# Altium schematic sheet MainControl20V05.SchDoc
size A1; Time: 2019-11-17
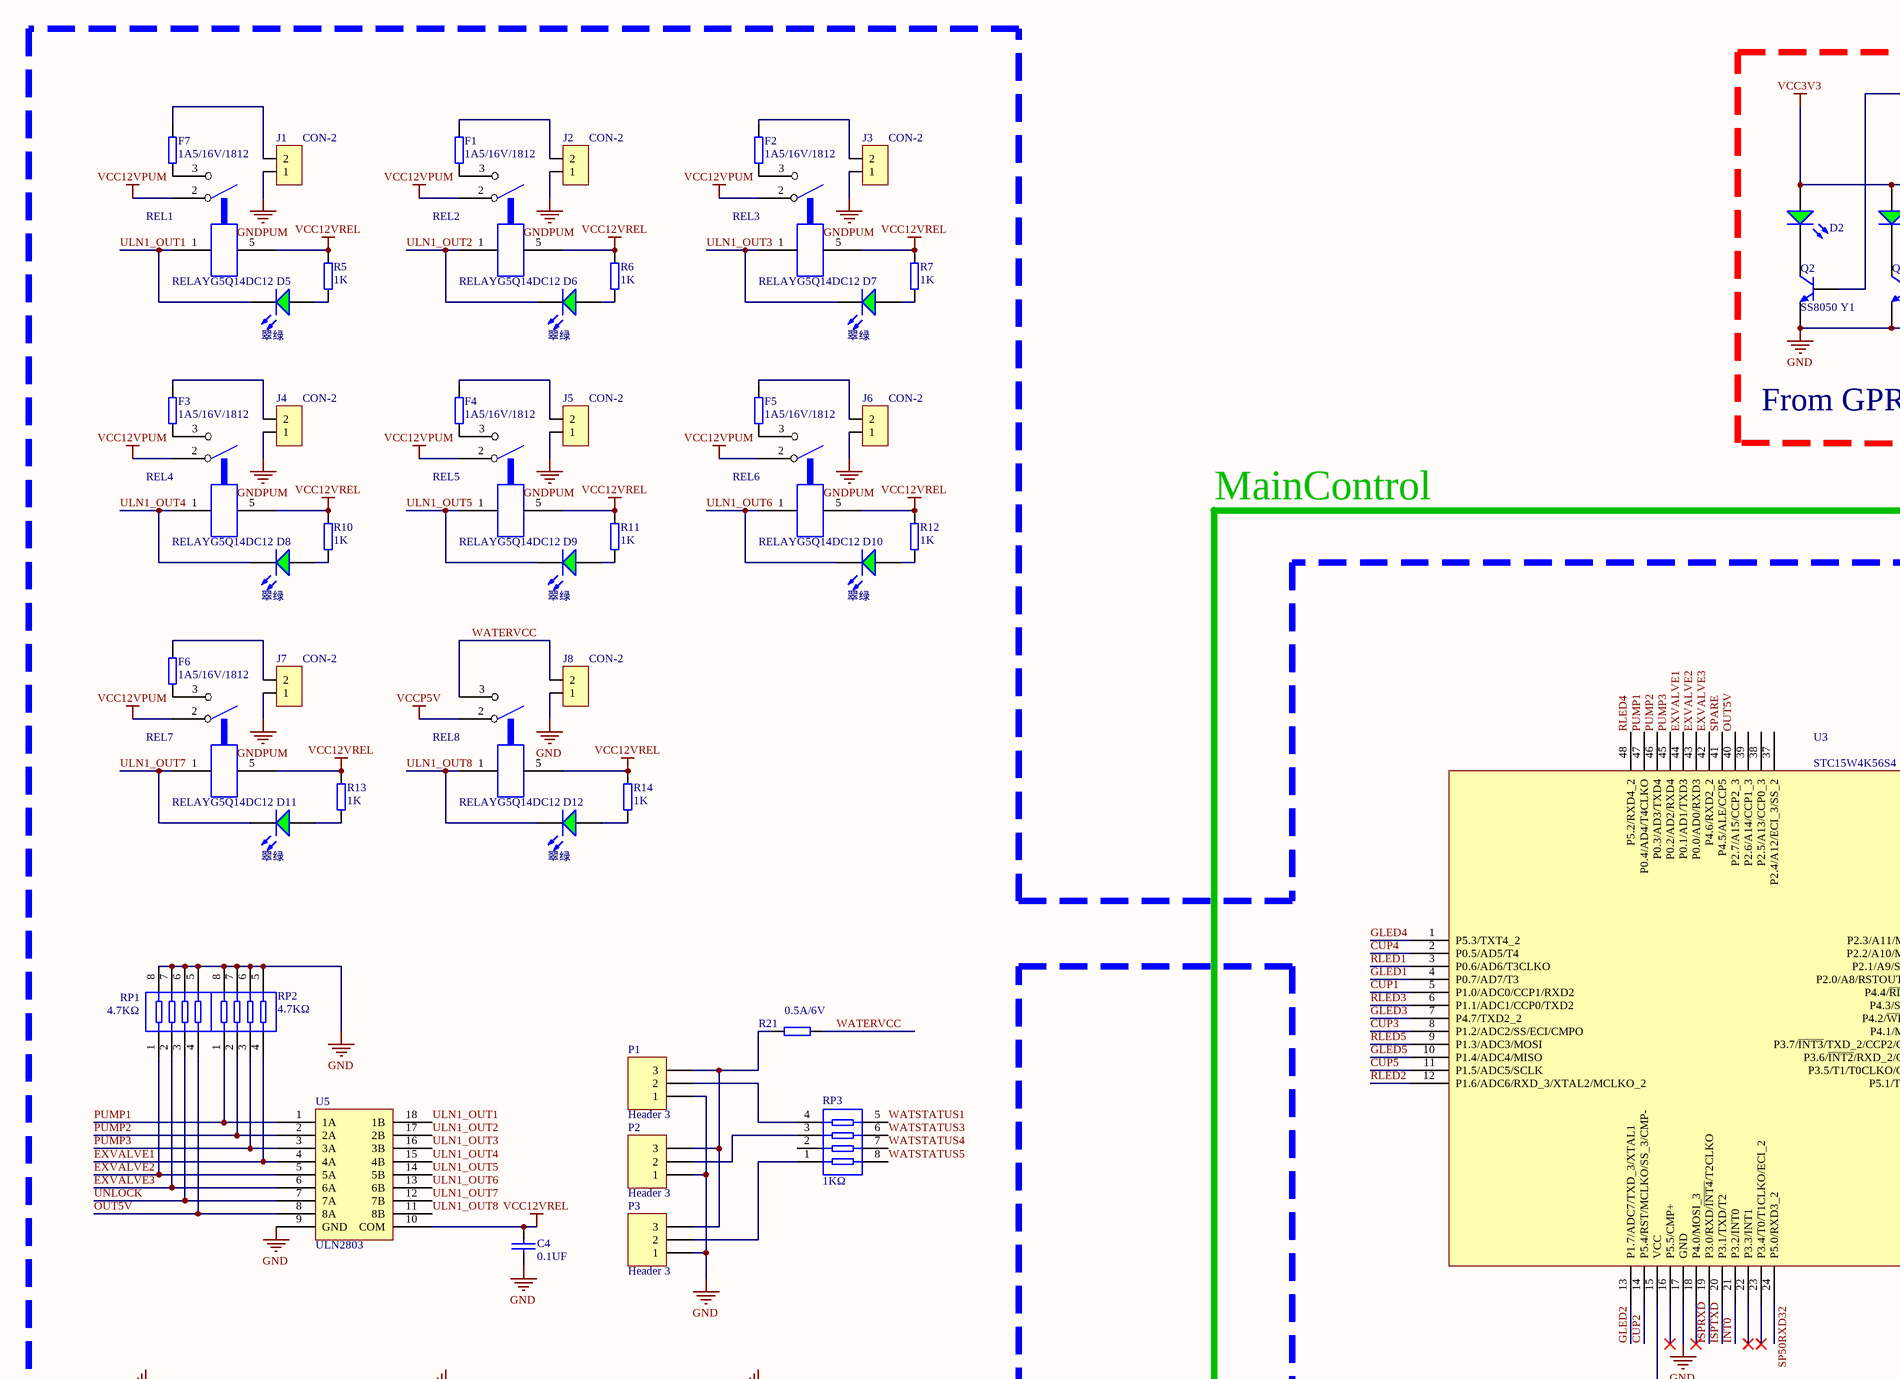
[diagram p0: MainControl20V05.SchDoc, top left]
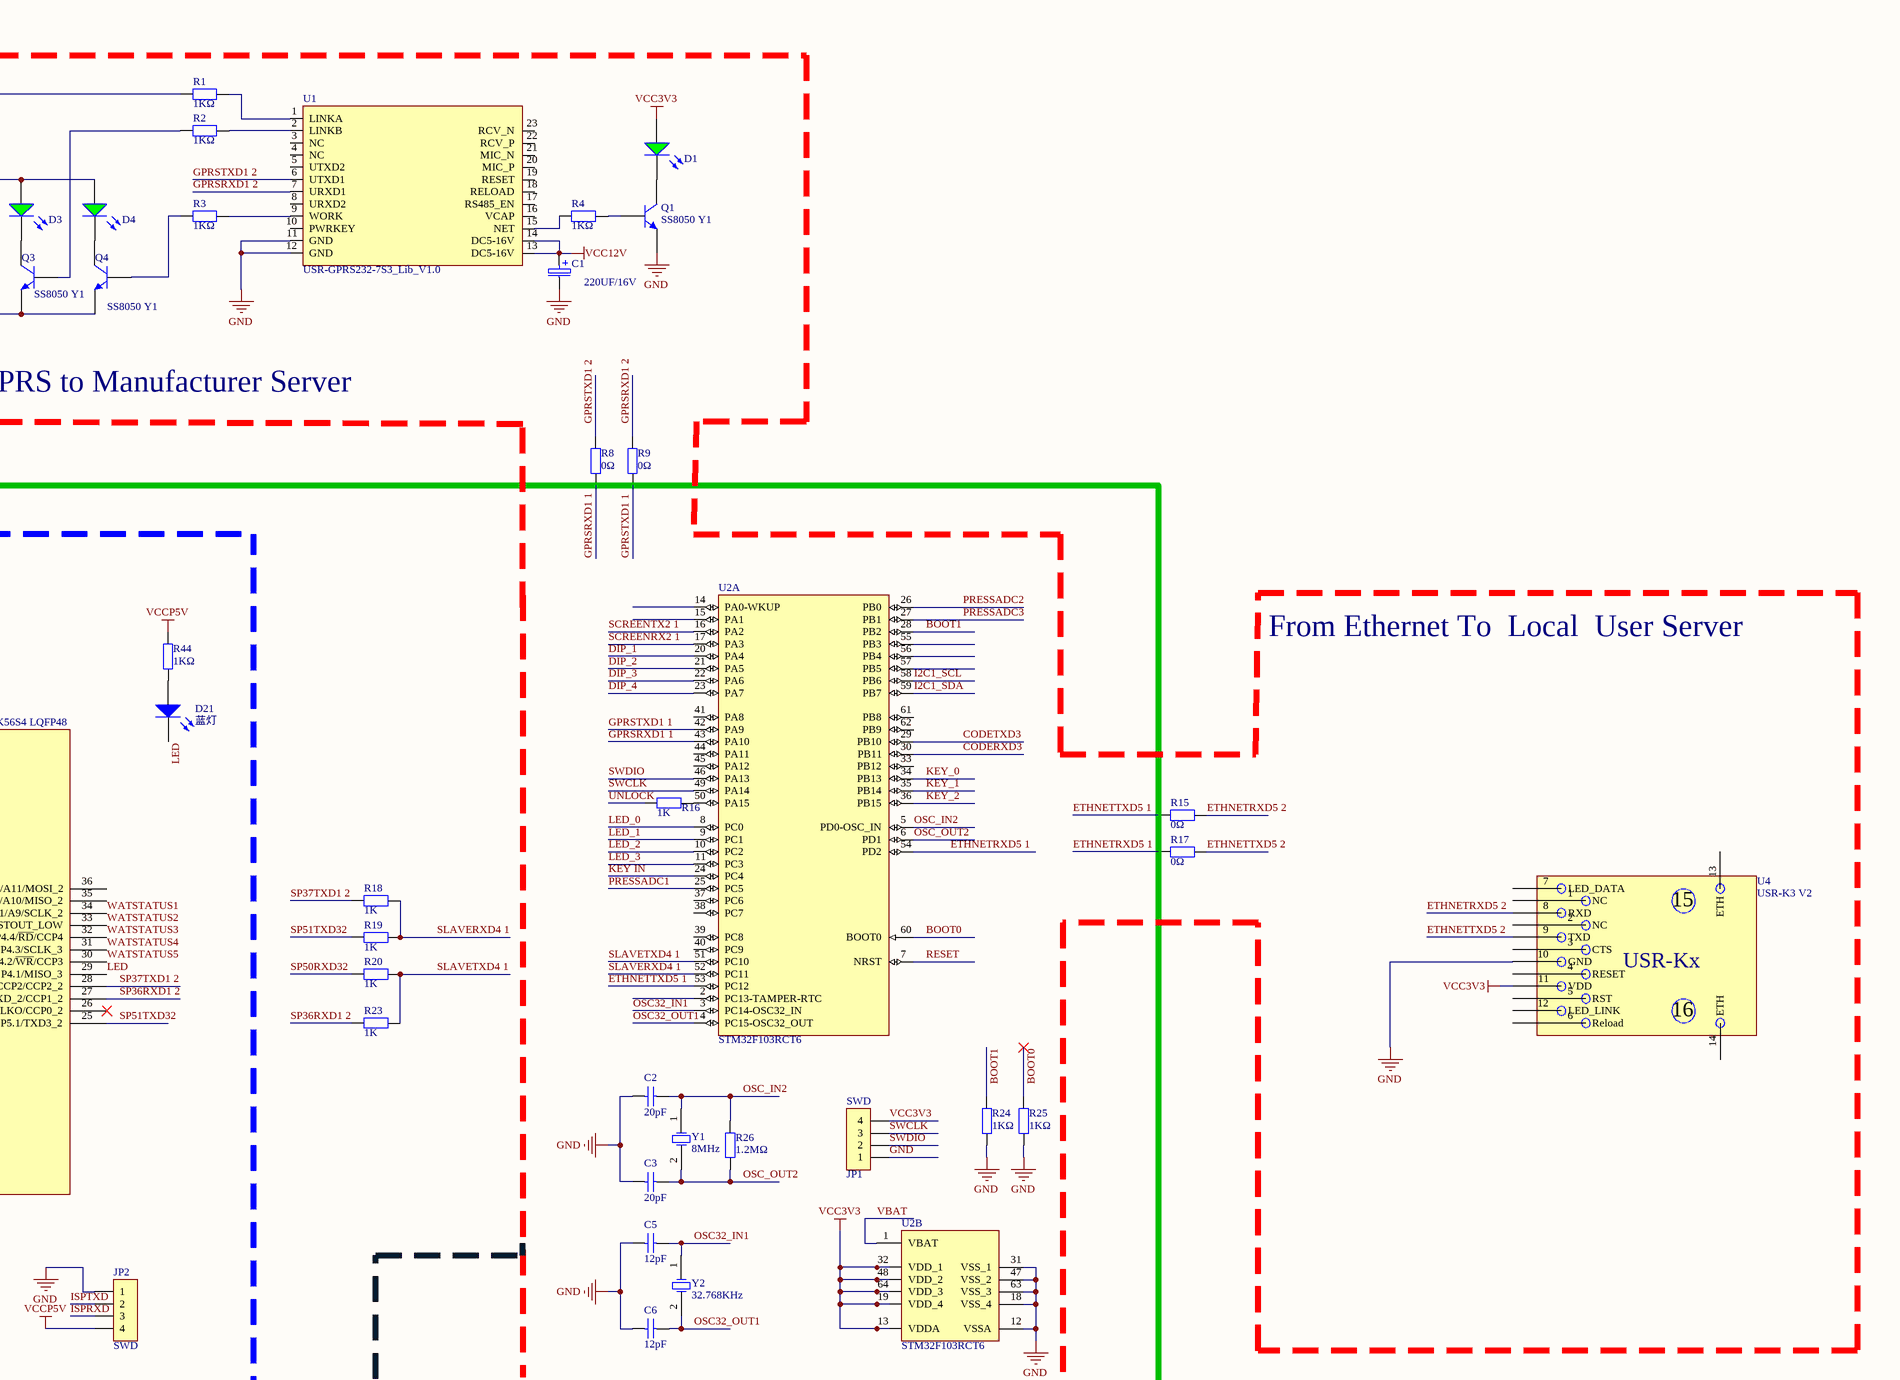
[diagram p1: MainControl20V05.SchDoc, top right]
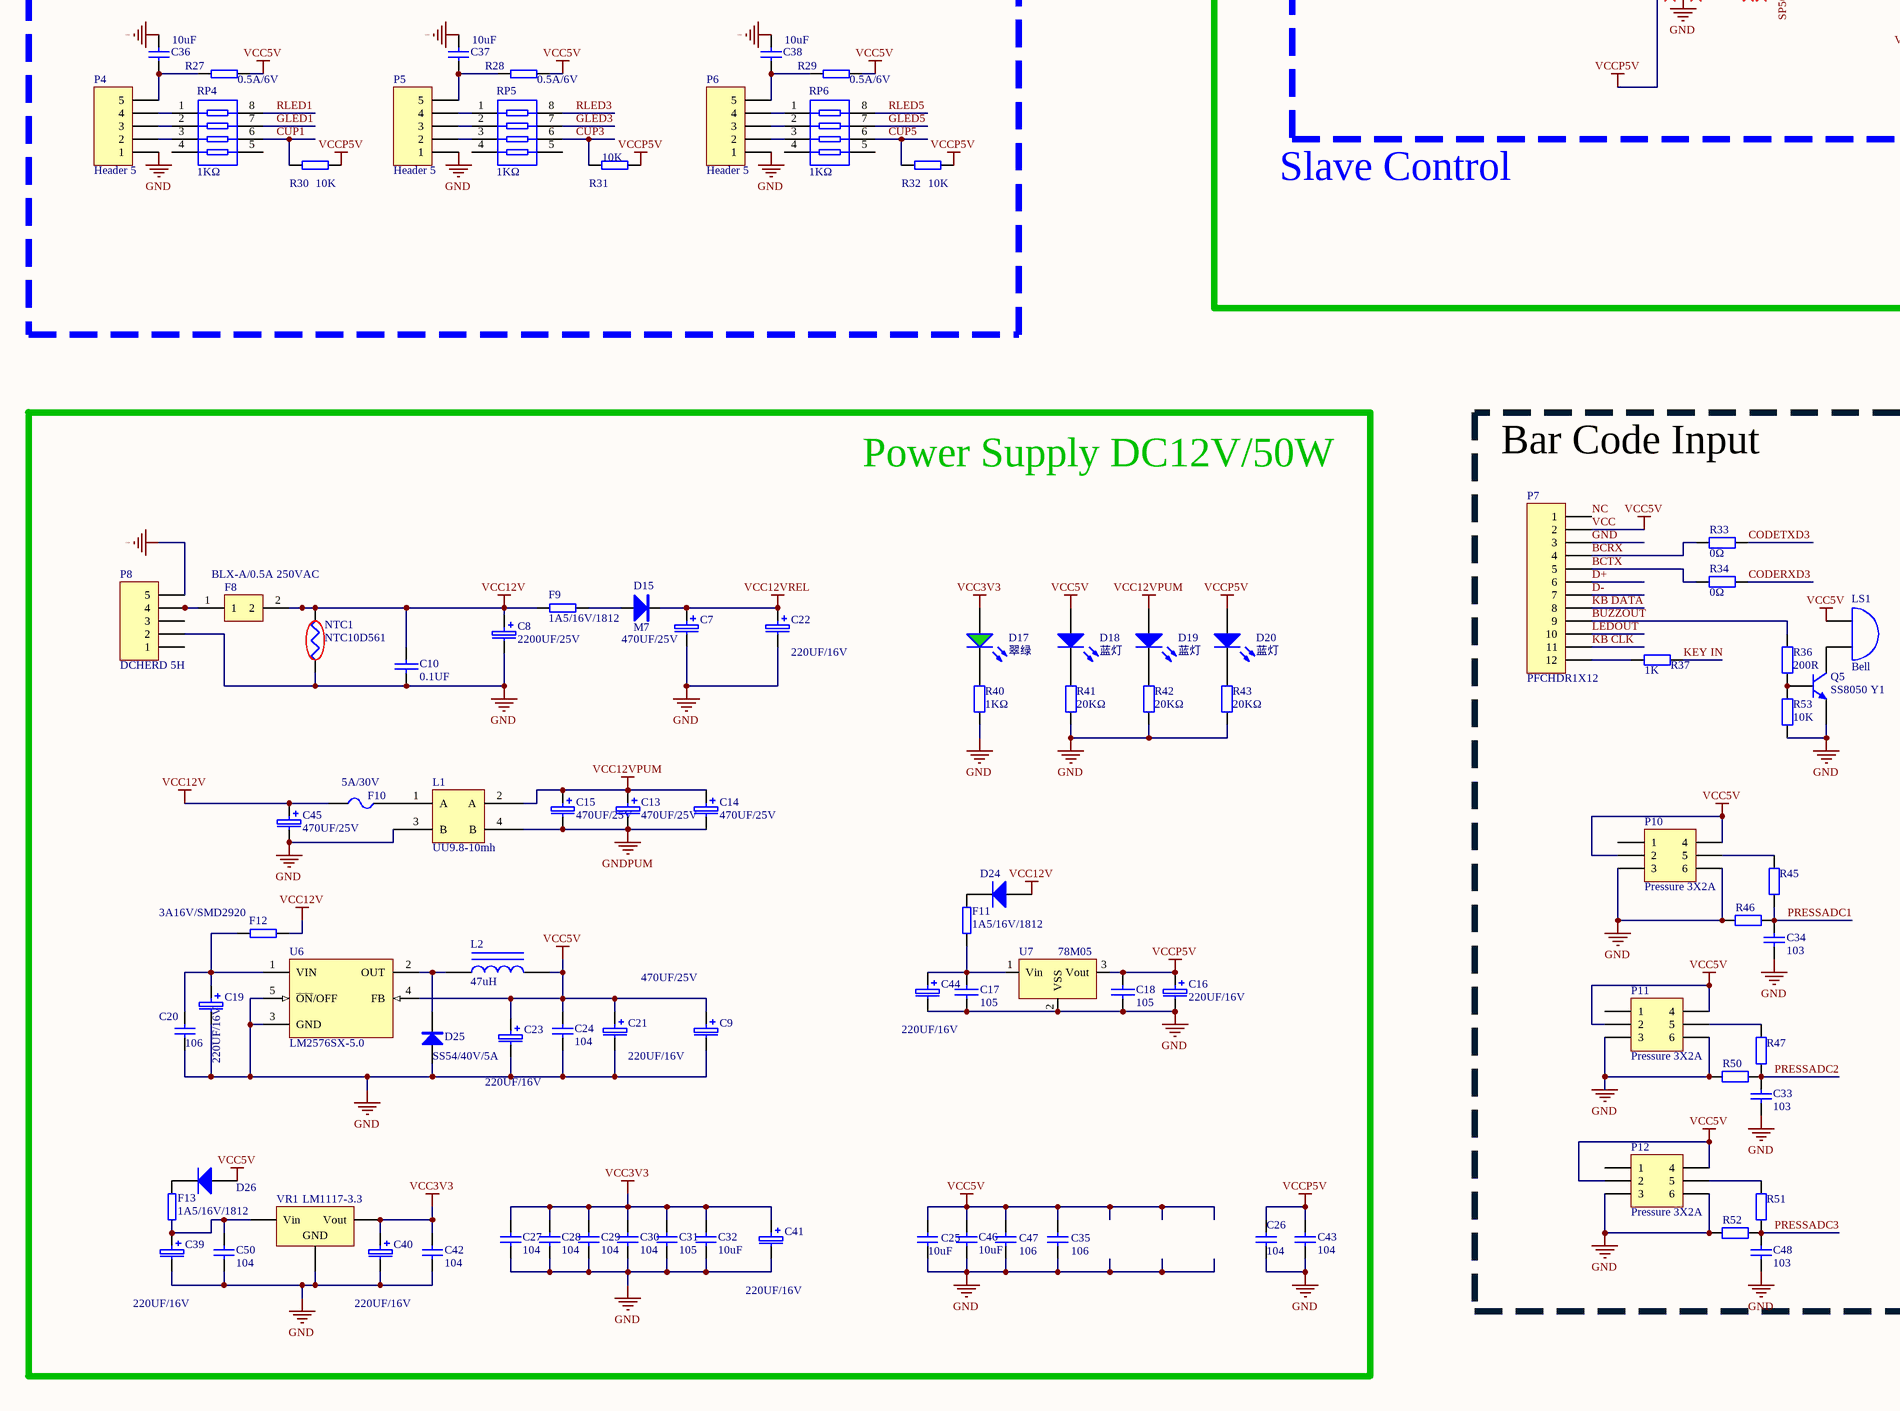
[diagram p2: MainControl20V05.SchDoc, bottom left]
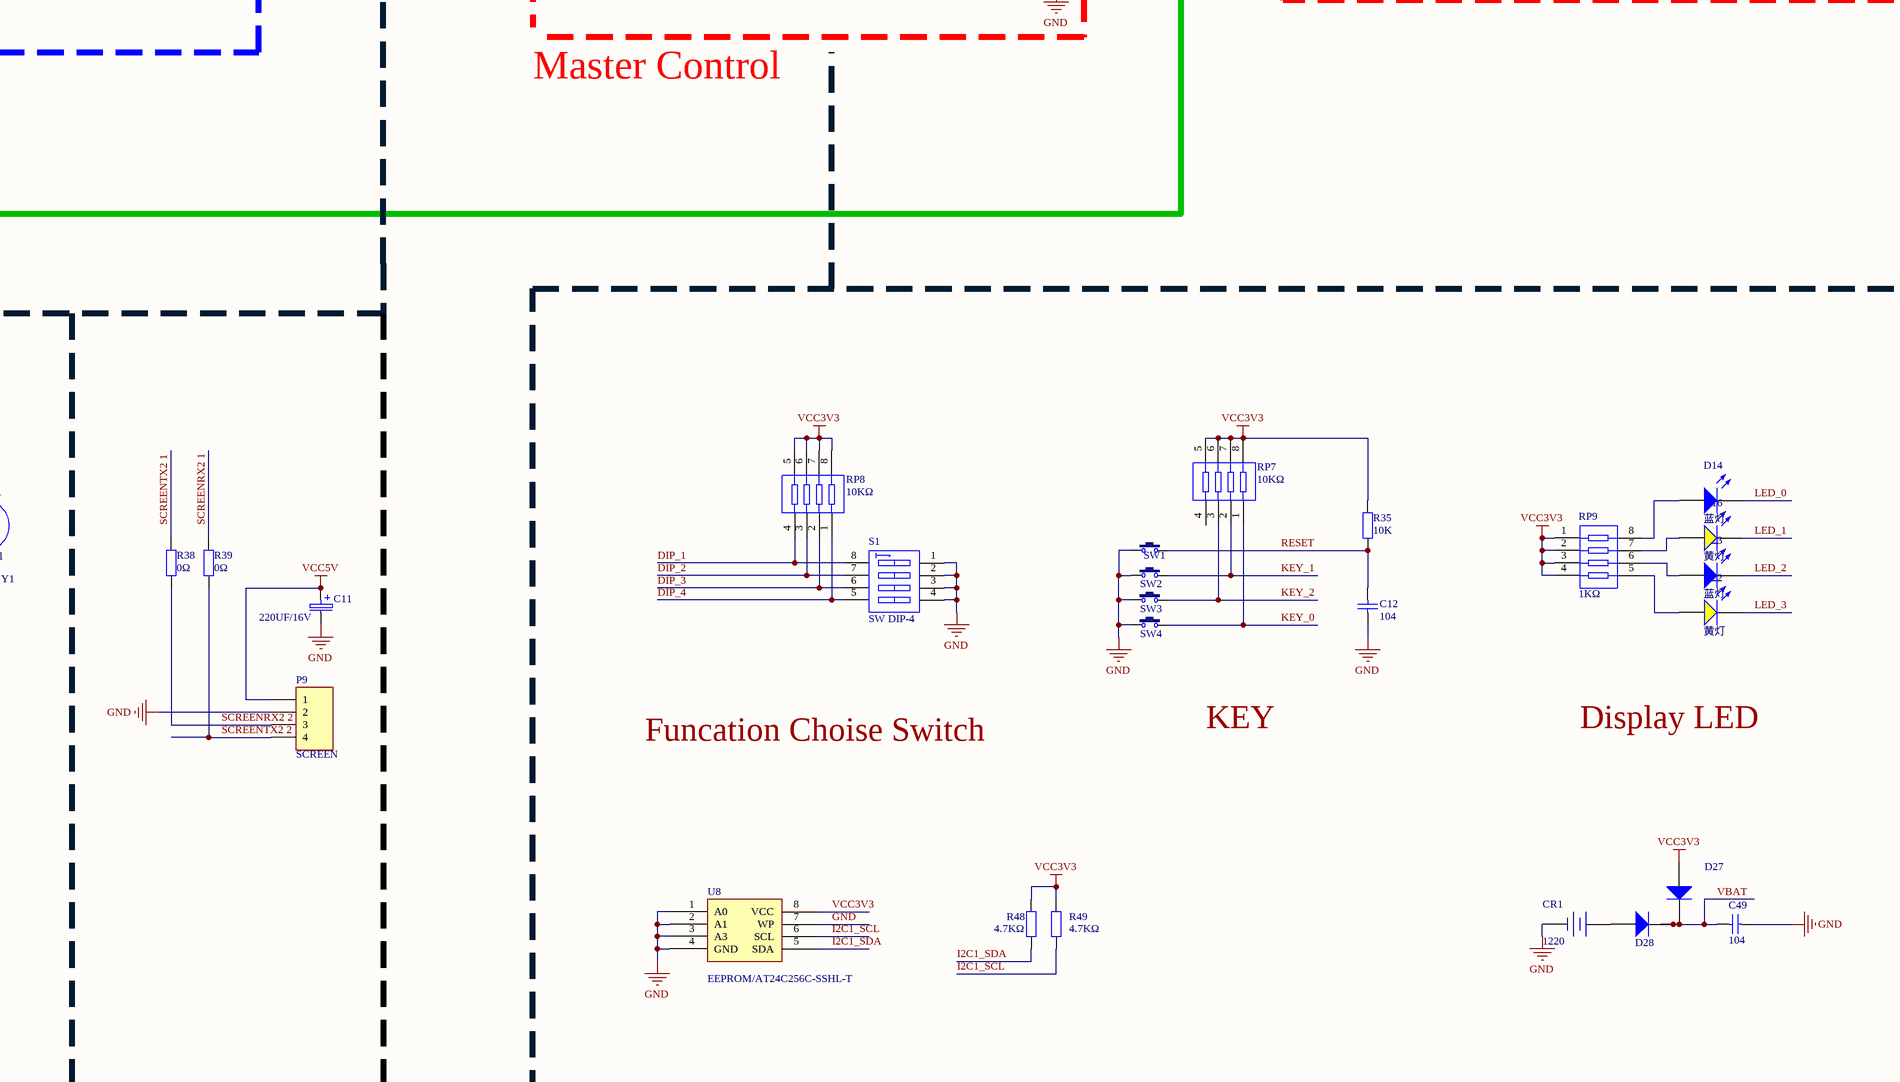
[diagram p3: MainControl20V05.SchDoc, bottom right]

## Parts
C1  220UF/16V  [6SMD-ECAP-6.3X7.7]
C2  20pF  [0805_C]
C3  20pF  [0805_C]
C4  0.1UF  [0805_C]
C5  12pF  [0805_C]
C6  12pF  [0805_C]
C7  470UF/25V  [C1020]
C8  2200UF/25V  [C3618]
C9  470UF/25V  [C1020]
C10  0.1UF  [0805_C]
C11  220UF/16V  [6SMD-ECAP-6.3X7.7]
C12  104  [0805_C]
C13  470UF/25V  [C1020]
C14  470UF/25V  [C1020]
C15  470UF/25V  [C1020]
C16  220UF/16V  [6SMD-ECAP-6.3X7.7]
C17  105  [0805_C]
C18  105  [0805_C]
C19  220UF/16V  [6SMD-ECAP-6.3X7.7]
C20  106  [1206_R]
C21  220UF/16V  [6SMD-ECAP-6.3X7.7]
C22  220UF/16V  [6SMD-ECAP-6.3X7.7]
C23  220UF/16V  [6SMD-ECAP-6.3X7.7]
C24  104  [0805_C]
C25  10uF  [0805_C]
C26  104  [0805_C]
C27  104  [0805_C]
C28  104  [0805_C]
C29  104  [0805_C]
C30  104  [0805_C]
C31  105  [0805_C]
C32  10uF  [0805_C]
C33  103  [0805_C]
C34  103  [0805_C]
C35  106  [0805_C]
C36  10uF  [0805_C]
C37  10uF  [0805_C]
C38  10uF  [0805_C]
C39  220UF/16V  [6SMD-ECAP-6.3X7.7]
C40  220UF/16V  [6SMD-ECAP-6.3X7.7]
C41  220UF/16V  [6SMD-ECAP-6.3X7.7]
C42  104  [0805_C]
C43  104  [0805_C]
C44  220UF/16V  [6SMD-ECAP-6.3X7.7]
C45  470UF/25V  [C1020]
C46  10uF  [0805_C]
C47  106
C48  103  [0805_C]
C49  104  [0805_C]
C50  104  [0805_C]
CR1  1220  [CR1220_A]
D1  翠绿  [0805_LED_S1]  (value not drawn)
D2  翠绿  [0805_LED_S1]  (value not drawn)
D3  翠绿  [0805_LED_S1]  (value not drawn)
D4  翠绿  [0805_LED_S1]  (value not drawn)
D5  翠绿  [0805_LED_S1]
D6  翠绿  [0805_LED_S1]
D7  翠绿  [0805_LED_S1]
D8  翠绿  [0805_LED_S1]
D9  翠绿  [0805_LED_S1]
D10  翠绿  [0805_LED_S1]
D11  翠绿  [0805_LED_S1]
D12  翠绿  [0805_LED_S1]
D14  蓝灯  [0805_LED_S1]
D15  M7  [DO-41]
D16  黄灯  [0805_LED_S1]
D17  翠绿  [0805_LED_S1]
D18  蓝灯  [0805_LED_S1]
D19  蓝灯  [0805_LED_S1]
D20  蓝灯  [0805_LED_S1]
D21  蓝灯  [0805_LED_S1]
D22  黄灯  [0805_LED_S1]
D23  蓝灯  [0805_LED_S1]
D24  LL4148 LL-34 1206  [LL-34]  (value not drawn)
D25  SS54/40V/5A  [SMC(DO-214AB)_S1]
D26  LL4148 LL-34 1206  [LL-34]  (value not drawn)
D27  LL4148 LL-34 1206  [LL-34]  (value not drawn)
D28  LL4148 LL-34 1206  [LL-34]  (value not drawn)
F1  1A5/16V/1812  [1812_R]
F2  1A5/16V/1812  [1812_R]
F3  1A5/16V/1812  [1812_R]
F4  1A5/16V/1812  [1812_R]
F5  1A5/16V/1812  [1812_R]
F6  1A5/16V/1812  [1812_R]
F7  1A5/16V/1812  [1812_R]
F8  BLX-A/0.5A 250VAC  [RL30-500]
F9  1A5/16V/1812  [1812_R]
F10  5A/30V  [RL30-500]
F11  1A5/16V/1812  [1812_R]
F12  3A16V/SMD2920  [SMD2920]
F13  1A5/16V/1812  [1812_R]
J1  CON-2  [F396P2-1]
J2  CON-2  [F396P2-1]
J3  CON-2  [F396P2-1]
J4  CON-2  [F396P2-1]
J5  CON-2  [F396P2-1]
J6  CON-2  [F396P2-1]
J7  CON-2  [F396P2-1]
J8  CON-2  [F396P2-1]
JP1  SWD  [HDR2.54-M-LI-4P]
JP2  SWD  [HDR2.54-M-LI-4P]
L1  UU9.8-10mh  [TRANS]
L2  47uH  [H4.7UH]
LS1  Bell  [BUZZ]
NTC1  NTC10D561  [NTC-10D]
P1  Header 3  [XHB3]
P2  Header 3  [XHB3]
P3  Header 3  [XHB3]
P4  Header 5  [XHB5]
P5  Header 5  [XHB5]
P6  Header 5  [XHB5]
P7  PFCHDR1X12  [FPC12/0.5]
P8  DCHERD 5H  [DCCON]
P9  SCREEN  [MHDR1X4]
P10  Pressure 3X2A  [PRESS]
P11  Pressure 3X2A  [PRESS]
P12  Pressure 3X2A  [PRESS]
Q1  SS8050 Y1  [SOT-23(SOT-23-3)]
Q2  SS8050 Y1  [SOT-23(SOT-23-3)]
Q3  SS8050 Y1  [SOT-23(SOT-23-3)]
Q4  SS8050 Y1  [SOT-23(SOT-23-3)]
Q5  SS8050 Y1  [SOT-23(SOT-23-3)]
R1  1KΩ  [0805_R]
R2  1KΩ  [0805_R]
R3  1KΩ  [0805_R]
R4  1KΩ  [0805_R]
R5  1K  [0805_R]
R6  1K  [0805_R]
R7  1K  [0805_R]
R8  0Ω  [0805_R]
R9  0Ω  [0805_R]
R10  1K  [0805_R]
R11  1K  [0805_R]
R12  1K  [0805_R]
R13  1K  [0805_R]
R14  1K  [0805_R]
R15  0Ω  [0805_R]
R16  1K  [0805_R]
R17  0Ω  [0805_R]
R18  1K  [0805_R]
R19  1K  [0805_R]
R20  1K  [0805_R]
R21  0.5A/6V  [1206_R]
R23  1K  [0805_R]
R24  1KΩ  [0805_R]
R25  1KΩ  [0805_R]
R26  1.2MΩ  [0805_R]
R27  0.5A/6V  [1206_R]
R28  0.5A/6V  [1206_R]
R29  0.5A/6V  [1206_R]
R30  10K  [0805_R]
R31  10K  [0805_R]
R32  10K  [0805_R]
R33  0Ω  [0805_R]
R34  0Ω  [0805_R]
R35  10K  [0805_R]
R36  200R  [0805_R]
R37  1K  [0805_R]
R38  0Ω  [0805_R]
R39  0Ω  [0805_R]
R40  1KΩ  [0805_R]
R41  20KΩ  [0805_R]
R42  20KΩ  [0805_R]
R43  20KΩ  [0805_R]
R44  1KΩ  [0805_R]
R45  68KΩ (6802) ±1%  [0805_R]  (value not drawn)
R46  91KΩ (9102) ±1%  [0805_R]  (value not drawn)
R47  68KΩ (6802) ±1%  [0805_R]  (value not drawn)
R48  4.7KΩ  [0805_R]
R49  4.7KΩ  [0805_R]
R50  91KΩ (9102) ±1%  [0805_R]  (value not drawn)
R51  68KΩ (6802) ±1%  [0805_R]  (value not drawn)
R52  91KΩ (9102) ±1%  [0805_R]  (value not drawn)
R53  10K  [0805_R]
REL1  RELAYG5Q14DC12  [G5Q1]
REL2  RELAYG5Q14DC12  [G5Q1]
REL3  RELAYG5Q14DC12  [G5Q1]
REL4  RELAYG5Q14DC12  [G5Q1]
REL5  RELAYG5Q14DC12  [G5Q1]
REL6  RELAYG5Q14DC12  [G5Q1]
REL7  RELAYG5Q14DC12  [G5Q1]
REL8  RELAYG5Q14DC12  [G5Q1]
RP1  4.7KΩ  [0603_Rx4]
RP2  4.7KΩ  [0603_Rx4]
RP3  1KΩ  [0603_Rx4]
RP4  1KΩ  [0603_Rx4]
RP5  1KΩ  [0603_Rx4]
RP6  1KΩ  [0603_Rx4]
RP7  10KΩ  [0603_Rx4]
RP8  10KΩ  [0603_Rx4]
RP9  1KΩ  [0603_Rx4]
S1  SW DIP-4  [SO8_N]
SW1  3x6x5  [TSW SMD-3*6*2.5]  (value not drawn)
SW2  3x6x5  [TSW SMD-3*6*2.5]  (value not drawn)
SW3  3x6x5  [TSW SMD-3*6*2.5]  (value not drawn)
SW4  3x6x5  [TSW SMD-3*6*2.5]  (value not drawn)
U1  USR-GPRS232-7S3_Lib_V1.0  [USERGPRS]
U2  STM32F103RCT6  [LQFP-64_10x10x05P]  (parts A,B of 2)
U3  STC15W4K56S4 LQFP48  [LQFP48]
U4  USR-K3 V2  [USERKX]
U5  ULN2803  [SOP18]
U6  LM2576SX-5.0  [TO-263-5]
U7  78M05  [D-PAK]
U8  EEPROM/AT24C256C-SSHL-T  [SOIC-8_150mil]
VR1  LM1117-3.3  [SOT-223]
Y1  8MHz  [SMD-5032_2P]
Y2  32.768KHz  [SMD-3215_2P FC - 135]

## Blocks framed on the sheet
Power Supply DC12V/50W: C7-C10 C13-C32 C35 C39-C47 C50 D15 D17-D20 D24-D26 F8-F13 L1 L2 NTC1 P8 R40-R43 U6 U7 VR1

## Nets
GND: C1.2 C2.1 C3.1 C4.2 C5.1 C6.1 C7.2 C8.2 C9.2 C10.2 C11.2 C12.1 C16.2 C17.2 C18.2 C19.2 C20.1 C21.2 C22.2 C23.2 C24.1 C25.1 C26.1 C27.1 C28.1 C29.1 C30.1 C31.1 C32.1 C33.1 C34.1 C35.1 C36.2 C37.2 C38.2 C39.2 C40.2 C41.2 C42.2 C43.1 C44.2 C45.2 C46.1 C47.1 C48.1 C49.1 C50.2 CR1.2(DC-) D25.1(A) J8.1 JP1.1 JP2.1 L1.3(B) NTC1.1 P1.1 P2.1 P3.1 P4.1 P5.1 P6.1 P7.3 P8.2 P8.5 P9.2 P10.3 P10.6 P11.3 P11.6 P12.3 P12.6 Q1.2(E) Q2.2(E) Q3.2(E) Q4.2(E) Q5.2(E) R24.1 R25.1 R40.1 R41.2 R42.2 R43.2 R46.1 R50.1 R52.1 R53.1 RP1.5 RP1.6 RP1.7 RP1.8 RP2.5 RP2.6 RP2.7 RP2.8 S1.1(A1) S1.2(A2) S1.3(A3) S1.4(A4) SW1.1 SW2.1 SW3.1 SW4.1 U1.11(GND) U1.12(GND) U2.12(VSSA) U2.18(VSS_4) U2.31(VSS_1) U2.47(VSS_2) U2.63(VSS_3) U3.17(GND) U4.10(GND) U5.9(GND) U6.3(GND) U6.5(~{ON}/OFF) U7.2(VSS) U8.1(A0) U8.2(A1) U8.3(A3) U8.4(GND) U8.7(WP) VR1.1(GND)
GNDPUM: C13.2 C14.2 C15.2 J1.1 J2.1 J3.1 J4.1 J5.1 J6.1 J7.1 L1.4(B)
VCC: C9.1 C11.1 C21.1 C23.1 C24.2 C25.2 C35.2 C46.2 C47.2 D18.A D26.1(A) L2.2 LS1.1(A) P7.2 P9.1 P10.2 P10.4 P11.2 P11.4 P12.2 P12.4 R27.1 R28.1 R29.1 U6.4(FB)  [also labelled VCC5V]
VCC3V3: C27.2 C28.2 C29.2 C30.2 C31.2 C32.2 C40.1 C41.1 C42.1 D1.A D2.A D3.A D4.A D17.A D27.1(A) JP1.4 R35.2 R48.2 R49.2 RP7.5 RP7.6 RP7.7 RP7.8 RP8.5 RP8.6 RP8.7 RP8.8 RP9.1 RP9.2 RP9.3 RP9.4 U2.13(VDDA) U2.19(VDD_4) U2.32(VDD_1) U2.48(VDD_2) U2.64(VDD_3) U4.11(VDD) U8.8(VCC) VR1.2(Vout)
VCC12V: C1.1 C8.1 C10.1 C45.1 D24.1(A) F8.2 F9.2 F10.1 F12.2 NTC1.2 U1.13(DC5-16V) U1.14(DC5-16V)
VCC12VPUM: C13.1 C14.1 C15.1 D19.A L1.2(A) REL1.2 REL2.2 REL3.2 REL4.2 REL5.2 REL6.2 REL7.2
VCC12VREL: C4.1 C7.1 C22.1 D15.2(K) R5.2 R6.2 R7.2 R10.2 R11.2 R12.2 R13.2 R14.2 REL1.5 REL2.5 REL3.5 REL4.5 REL5.5 REL6.5 REL7.5 REL8.5 U5.10(COM)
VCCP5V: C16.1 C18.1 C26.2 C43.2 D20.A JP2.4 R30.1 R31.1 R32.1 R44.2 REL8.2 U3.15(VCC) U7.3(Vout)
BCRX: P7.4 R33.1
BCTX: P7.5 R34.1
BOOT0: R25.2 U2.60(BOOT0)
BOOT1: R24.2 U2.28(PB2)
BUZZOUT: P7.9 R36.2
CODERXD3: R34.2 U2.30(PB11)
CODETXD3: R33.2 U2.29(PB10)
CUP1: R30.2 RP4.6 U3.5(P1.0/ADC0/CCP1/RXD2)
CUP2: U3.14(P5.4/RST/MCLKO/SS_3/CMP-)
CUP3: R31.2 RP5.6 U3.8(P1.2/ADC2/SS/ECI/CMPO)
CUP4: U3.2(P0.5/AD5/T4)
CUP5: R32.2 RP6.6 U3.11(P1.5/ADC5/SCLK)
D+: P7.6
D-: P7.7
DIP_1: RP8.4 S1.8(B1) U2.20(PA4)
DIP_2: RP8.3 S1.7(B2) U2.21(PA5)
DIP_3: RP8.2 S1.6(B3) U2.22(PA6)
DIP_4: RP8.1 S1.5(B4) U2.23(PA7)
ETHNETRXD5 1: R17.1 U2.54(PD2)
ETHNETRXD5 2: R15.2 U4.8(RXD)
ETHNETTXD5 1: R15.1 U2.53(PC12)
ETHNETTXD5 2: R17.2 U4.9(TXD)
EXVALVE1: RP2.4 U3.44(P0.1/AD1/TXD3) U5.4(4A)
EXVALVE2: RP1.1 U3.43(P0.0/AD0/RXD3) U5.5(5A)
EXVALVE3: RP1.2 U3.42(P4.6/RXD2_2) U5.6(6A)
GLED1: RP4.7 U3.4(P0.7/AD7/T3)
GLED2: U3.13(P1.7/ADC7/TXD_3/XTAL1)
GLED3: RP5.7 U3.7(P4.7/TXD2_2)
GLED4: U3.1(P5.3/TXT4_2)
GLED5: RP6.7 U3.10(P1.4/ADC4/MISO)
GPRSRXD1 1: R8.1 U2.43(PA10)
GPRSRXD1 2: R9.2 U1.7(URXD1)
GPRSTXD1 1: R9.1 U2.42(PA9)
GPRSTXD1 2: R8.2 U1.6(UTXD1)
I2C1_SCL: R49.1 U2.58(PB6) U8.6(SCL)
I2C1_SDA: R48.1 U2.59(PB7) U8.5(SDA)
INT0: U3.21(P3.2/INT0)
ISPRXD: JP2.3 U3.19(P3.0/RXD/~{INT4}/T2CLKO)
ISPTXD: JP2.2 U3.20(P3.1/TXD/T2)
KB CLK: P7.11
KB DATA: P7.8
KEY IN: R37.2 U2.24(PC4)
KEY_0: RP7.1 SW4.2 U2.34(PB13)
KEY_1: RP7.2 SW2.2 U2.35(PB14)
KEY_2: RP7.3 SW3.2 U2.36(PB15)
LED: D21.K U3.29(P4.1/MISO_3)
LED_0: D14.K U2.8(PC0)
LED_1: D16.K U2.9(PC1)
LED_2: D23.K U2.10(PC2)
LED_3: D22.K U2.11(PC3)
LEDOUT: P7.10
NC: P7.1
OSC32_IN1: C5.2 U2.3(PC14-OSC32_IN) Y2.1(OSC1)
OSC32_OUT1: C6.2 U2.4(PC15-OSC32_OUT) Y2.2(OSC2)
OSC_IN2: C2.2 R26.2 U2.5(PD0-OSC_IN) Y1.1(OSC1)
OSC_OUT2: C3.2 R26.1 U2.6(PD1) Y1.2(OSC2)
OUT5V: RP1.4 U3.40(P2.7/A15/CCP2_3) U5.8(8A)
PRESSADC1: C34.2 R45.1 R46.2 U2.25(PC5)
PRESSADC2: C33.2 R47.1 R50.2 U2.26(PB0)
PRESSADC3: C48.2 R51.1 R52.2 U2.27(PB1)
PUMP1: RP2.1 U3.47(P0.4/AD4/T4CLKO) U5.1(1A)
PUMP2: RP2.2 U3.46(P0.3/AD3/TXD4) U5.2(2A)
PUMP3: RP2.3 U3.45(P0.2/AD2/RXD4) U5.3(3A)
RESET: C12.2 R35.1 SW1.2 U2.7(NRST)
RLED1: RP4.8 U3.3(P0.6/AD6/T3CLKO)
RLED2: U3.12(P1.6/ADC6/RXD_3/XTAL2/MCLKO_2)
RLED3: RP5.8 U3.6(P1.1/ADC1/CCP0/TXD2)
RLED4: U3.48(P5.2/RXD4_2)
RLED5: RP6.8 U3.9(P1.3/ADC3/MOSI)
SCREENRX2 1: R39.2 U2.17(PA3)
SCREENRX2 2: P9.3 R38.1
SCREENTX2 1: R38.2 U2.16(PA2)
SCREENTX2 2: P9.4 R39.1
SLAVERXD4 1: R18.2 R19.2 U2.52(PC11)
SLAVETXD4 1: R20.2 R23.2 U2.51(PC10)
SP36RXD1 2: R23.1 U3.27(P3.6/~{INT2}/RXD_2/CCP1_2)
SP37TXD1 2: R18.1 U3.28(P3.7/~{INT3}/TXD_2/CCP2/CCP2_2)
SP50RXD32: R20.1 U3.24(P5.0/RXD3_2)
SP51TXD32: R19.1 U3.25(P5.1/TXD3_2)
SPARE: U3.41(P4.5/ALE/CCP5)
SWCLK: JP1.3 U2.49(PA14)
SWDIO: JP1.2 U2.46(PA13)
ULN1_OUT1: D5.K REL1.1 U5.18(1B)
ULN1_OUT2: D6.K REL2.1 U5.17(2B)
ULN1_OUT3: D7.K REL3.1 U5.16(3B)
ULN1_OUT4: D8.K REL4.1 U5.15(4B)
ULN1_OUT5: D9.K REL5.1 U5.14(5B)
ULN1_OUT6: D10.K REL6.1 U5.13(6B)
ULN1_OUT7: D11.K REL7.1 U5.12(7B)
ULN1_OUT8: D12.K REL8.1 U5.11(8B)
UNLOCK: R16.1 RP1.3 U5.7(7A)
VBAT: C49.2 D27.2(K) D28.2(K) U2.1(VBAT)
WATERVCC: J8.2 R21.1 REL8.3
WATSTATUS1: RP3.5 U3.34(P2.1/A9/SCLK_2)
WATSTATUS2: U3.33(P2.0/A8/RSTOUT_LOW)
WATSTATUS3: RP3.6 U3.32(P4.4/~{RD}/CCP4)
WATSTATUS4: RP3.7 U3.31(P4.3/SCLK_3)
WATSTATUS5: RP3.8 U3.30(P4.2/~{WR}/CCP3)
NetC17_1: C17.1 C44.1 F11.1 U7.1(Vin)
NetC19_1: C19.1 C20.2 F12.1 U6.1(VIN)
NetC36_1: C36.1 P4.5 R27.2
NetC37_1: C37.1 P5.5 R28.2
NetC38_1: C38.1 P6.5 R29.2
NetC39_1: C39.1 C50.1 F13.1 VR1.3(Vin)
NetCR1_1: CR1.1(DC+) D28.1(A)
NetD1_K: D1.K Q1.3(C)
NetD2_K: D2.K Q2.3(C)
NetD3_K: D3.K Q3.3(C)
NetD4_K: D4.K Q4.3(C)
NetD5_A: D5.A R5.1
NetD6_A: D6.A R6.1
NetD7_A: D7.A R7.1
NetD8_A: D8.A R10.1
NetD9_A: D9.A R11.1
NetD10_A: D10.A R12.1
NetD11_A: D11.A R13.1
NetD12_A: D12.A R14.1
NetD14_A: D14.A RP9.8
NetD15_1: D15.1(A) F9.1
NetD16_A: D16.A RP9.7
NetD17_K: D17.K R40.2
NetD18_K: D18.K R41.1
NetD19_K: D19.K R42.1
NetD20_K: D20.K R43.1
NetD21_A: D21.A R44.1
NetD22_A: D22.A RP9.5
NetD23_A: D23.A RP9.6
NetD24_2: D24.2(K) F11.2
NetD25_2: D25.2(K) L2.1 U6.2(OUT)
NetD26_2: D26.2(K) F13.2
NetF1_1: F1.1 REL2.3
NetF1_2: F1.2 J2.2
NetF2_1: F2.1 REL3.3
NetF2_2: F2.2 J3.2
NetF3_1: F3.1 REL4.3
NetF3_2: F3.2 J4.2
NetF4_1: F4.1 REL5.3
NetF4_2: F4.2 J5.2
NetF5_1: F5.1 REL6.3
NetF5_2: F5.2 J6.2
NetF6_1: F6.1 REL7.3
NetF6_2: F6.2 J7.2
NetF7_1: F7.1 REL1.3
NetF7_2: F7.2 J1.2
NetF8_1: F8.1 P8.4
NetF10_2: F10.2 L1.1(A)
NetLS1_2: LS1.2(B) Q5.3(C)
NetP1_2: P1.2 RP3.4
NetP1_3: P1.3 P2.3 P3.3 R21.2
NetP2_2: P2.2 RP3.3
NetP3_2: P3.2 RP3.1
NetP4_2: P4.2 RP4.3
NetP4_3: P4.3 RP4.2
NetP4_4: P4.4 RP4.1
NetP5_2: P5.2 RP5.3
NetP5_3: P5.3 RP5.2
NetP5_4: P5.4 RP5.1
NetP6_2: P6.2 RP6.3
NetP6_3: P6.3 RP6.2
NetP6_4: P6.4 RP6.1
NetP7_12: P7.12 R37.1
NetP10_5: P10.5 R45.2
NetP11_5: P11.5 R47.2
NetP12_5: P12.5 R51.2
NetQ1_1: Q1.1(B) R4.1
NetQ2_1: Q2.1(B) R1.1
NetQ3_1: Q3.1(B) R2.1
NetQ4_1: Q4.1(B) R3.1
NetQ5_1: Q5.1(B) R36.1 R53.2
NetR1_2: R1.2 U1.1(LINKA)
NetR2_2: R2.2 U1.2(LINKB)
NetR3_2: R3.2 U1.9(WORK)
NetR4_2: R4.2 U1.15(NET)
NetR16_2: R16.2 U2.50(PA15)

Not connected (* = marked no-connect by the designer): P8 1 3; P10 1; P11 1; P12 1; RP3 2; RP4 4 5; RP5 4 5; RP6 4 5; RP7 4; U1 3(NC) 4(NC) 5(UTXD2) 8(URXD2) 10(PWRKEY) 16(VCAP) 17(RS485_EN) 18(RELOAD) 19(RESET) 20(MIC_P) 21(MIC_N) 22(RCV_P) 23(RCV_N); U2 2(PC13-TAMPER-RTC) 14(PA0-WKUP) 15(PA1) 33(PB12) 37(PC6) 38(PC7) 39(PC8) 40(PC9) 41(PA8) 44(PA11) 45(PA12) 55(PB3) 56(PB4) 57(PB5) 61(PB8) 62(PB9); U3 16(P5.5/CMP+)* 18(P4.0/MOSI_3)* 22(P3.3/INT1)* 23(P3.4/T0/T1CLKO/ECI_2)* 26(P3.5/T1/T0CLKO/CCP0_2)* 35(P2.2/A10/MISO_2) 36(P2.3/A11/MOSI_2) 37(P2.4/A12/ECI_3/SS_2) 38(P2.5/A13/CCP0_3) 39(P2.6/A14/CCP1_3); U4 1(NC) 2(NC) 3(CTS) 4(RESET) 5(RST) 6(Reload) 7(LED_DATA) 12(LED_LINK) 13(ETH) 14(ETH)

## Notes on the sheet
- From GPRS to Manufacturer Server
- MainControl
- From Ethernet To  Local  User Server
- Slave Control
- Master Control
- Bar Code Input
- Funcation Choise Switch
- KEY
- Display LED
- Title
- Size:
- Date:
- File:
- A2
- Number:
- Time:
- Revision:
- Sheet
- of
- (in symbol USR-K3 V2) 15; USR-Kx; 16

## Library data of the parts
C1 C7-C9 C11 C13-C16 C19 C21-C23 C39-C41 C44 C45 = EC
C2 C3 C5 C6 = 1206 470pF (471) 10% 50V: 贴片电容; ComponentLink1Description: 供应商链接; ComponentLink1URL: http://www.szlcsc.com/product/details_2220.html; Package: 1206; Supplier: LC; SuppliersPartNumber: C1868
C4 C17 C18 = CAP-SMD: Cap; Stuff: *; Capability: *; Voltage: *; Footprint: *
C10 = CAP-X: 安规电容 X2 275V 0.1uF 100nF 104K 脚距10mm
C12 C25-C34 C36-C38 C42 C43 C46 C48-C50 = 1206 100nF (104) 10% 50V: 贴片电容; ComponentLink1Description: 供应商链接; ComponentLink1URL: http://www.szlcsc.com/product/details_25237.html; Package: 1206; Supplier: LC; SuppliersPartNumber: C24497
C20 C35 C47 = 1206 10uF (106) 10% 50V: 贴片电容; ComponentLink1Description: 供应商链接; ComponentLink1URL: http://www.szlcsc.com/product/details_14236.html; Package: 1206; Supplier: LC; SuppliersPartNumber: C13585
C24 = 1206 220nF (224) 10% 50V: 贴片电容; ComponentLink1Description: 供应商链接; ComponentLink1URL: http://www.szlcsc.com/product/details_2209.html; Package: 1206; Supplier: LC; SuppliersPartNumber: C1857
CR1 = CR-3V: 微型电池; 版权归属: 源创客; BOM名称: 微型电池; 学习资源: www.ooocke.com
D1-D12 D17 = 0805 翠绿: 发光二极管; ComponentLink1Description: 供应商链接; ComponentLink1URL: http://www.szlcsc.com/product/details_2670.html; Package: 0805; Supplier: LC; SuppliersPartNumber: C2297
D14 D18-D21 D23 = 0805 蓝灯: 发光二极管; ComponentLink1Description: 供应商链接; ComponentLink1URL: http://www.szlcsc.com/product/details_2666.html; Package: 0805; Supplier: LC; SuppliersPartNumber: C2293
D16 D22 = 0805 黄灯: 发光二极管; ComponentLink1Description: 供应商链接; ComponentLink1URL: http://www.szlcsc.com/product/details_2669.html; Package: 0805; Supplier: LC; SuppliersPartNumber: C2296
D24 D26-D28 = LL-34 LL4148 LL-34 1206: 开关二极管; ComponentLink1Description: 供应商链接; ComponentLink1URL: http://www.szlcsc.com/product/details_10338.html; Package: LL-34; Supplier: LC; SuppliersPartNumber: C9808
D25 = 1N5819: 肖特基二极管; 版权归属: 源创客; 属性: 40V/2A; BOM名称: 肖特基二极管; 学习资源: www.ooocke.com
F1-F7 F9 F11-F13 = RES-SMD: SMD; Precision: *; Ohm: *; Footprint: *; Stuff: *
F8 = BLX-A
F10 = FU: 贴片保险丝; 版权归属: 源创客; BOM名称: 贴片保险丝; 学习资源: www.ooocke.com
JP1 JP2 = Header 4: 4P接插件; 版权归属: 源创客; BOM名称: 4P接插件; 学习资源: www.ooocke.com
L1 = INL-9.8MM
L2 = 1206 10uH 10%: 贴片电感; ComponentLink1Description: 供应商链接; ComponentLink1URL: http://www.szlcsc.com/product/details_1403.html; Package: 1206; Supplier: LC; SuppliersPartNumber: C1051
LS1 = Bell: Electrical Bell; Published: 24-Mar-1999; LatestRevisionDate: 17-Jul-2002; LatestRevisionNote: Re-released for DXP Platform.; PackageReference: PIN2; Publisher: Altium Limited
NTC1 = NTC
P1-P3 = Header 3: Header, 3-Pin; LatestRevisionDate: 17-Jul-2002; LatestRevisionNote: Re-released for DXP Platform.; Publisher: Altium Limited
P4-P6 = Header 5: Header, 5-Pin; LatestRevisionDate: 17-Jul-2002; LatestRevisionNote: Re-released for DXP Platform.; Publisher: Altium Limited
P7 = MHDR1X12: Header, 12-Pin; LatestRevisionDate: 17-Jul-2002; LatestRevisionNote: Re-released for DXP Platform.; Publisher: Altium Limited
P8 = Header 5H: Header, 5-Pin, Right Angle; LatestRevisionDate: 17-Jul-2002; LatestRevisionNote: Re-released for DXP Platform.; Publisher: Altium Limited
P9 = MHDR1X4: Header, 4-Pin; LatestRevisionDate: 17-Jul-2002; LatestRevisionNote: Re-released for DXP Platform.; Publisher: Altium Limited
P10-P12 = Header 3X2A: Header, 3-Pin, Dual row; LatestRevisionDate: 17-Jul-2002; LatestRevisionNote: Re-released for DXP Platform.; Publisher: Altium Limited
Q1-Q5 = SOT-23 SS8050 Y1: 三极管; ComponentLink1Description: 供应商链接; ComponentLink1URL: http://www.szlcsc.com/product/details_2507.html; Package: SOT-23; Supplier: LC; SuppliersPartNumber: C2150
R1-R4 R24 R25 R40-R44 R48 R49 = 1206 1KΩ (1001) 1%: 贴片电阻; ComponentLink1Description: 供应商链接; ComponentLink1URL: http://www.szlcsc.com/product/details_4817.html; Package: 1206; Supplier: LC; SuppliersPartNumber: C4410
R5-R7 R10-R14 R21 R27-R32 = RES
R8 R9 R15-R20 R23 R33-R39 R53 = 1206 0Ω (0R0) 1%: 贴片电阻; ComponentLink1Description: 供应商链接; ComponentLink1URL: http://www.szlcsc.com/product/details_18576.html; Package: 1206; Supplier: LC; SuppliersPartNumber: C17888
R26 = 1206 1.2MΩ (1204) 1%: 贴片电阻; ComponentLink1Description: 供应商链接; ComponentLink1URL: http://www.szlcsc.com/product/details_22832.html; Package: 1206; Supplier: LC; SuppliersPartNumber: C22107
R45 R47 R51 = 0805 68KΩ (6802) 1%: 贴片电阻; ComponentLink1Description: 供应商链接; ComponentLink1URL: http://www.szlcsc.com/product/details_18489.html; Package: 0805; Supplier: LC; SuppliersPartNumber: C17801
R46 R50 R52 = 0805 91KΩ (9102) 1%: 贴片电阻; ComponentLink1Description: 供应商链接; ComponentLink1URL: http://www.szlcsc.com/product/details_18554.html; Package: 0805; Supplier: LC; SuppliersPartNumber: C17866
RP1-RP9 = 0603*4  1KΩ (102) 5%: 贴片排阻; ComponentLink1Description: 供应商链接; ComponentLink1URL: http://www.szlcsc.com/product/details_20907.html; Package: 0603*4; Supplier: LC; SuppliersPartNumber: C20197
S1 = SW DIP-4: DIP Switch, 4 Position, SPST; Published: 24-Mar-1999; LatestRevisionDate: 29-May-2009; LatestRevisionNote: IPC-7351 Footprint Added.; PackageVersion: Dec-2002; PackageReference: SO8; Publisher: Altium Limited; PackageDescription: 8-Pin Small Outline Integrated Circuit 1.27 mm Pitch; Code_JEDEC: MS-012-AA; Code_IPC: SOIC127P600-8
SW1-SW4 = TSW 3x6: 3x6轻触开关; 版权归属: 源创客; BOM名称: 3x6轻触开关; 学习资源: www.ooocke.com
U2 = STM32F103RCT6: ARM; ComponentLink1Description: 供应商链接; ComponentLink1URL: http://www.szlcsc.com/product/details_8815.html; Package: LQFP-64_10x10x05P; Supplier: LC; SuppliersPartNumber: C8323
U3 = STC15W4K60S4 LQFP48
U6 = LM2576SX-5.0_[C34465]: DC-DC芯片; ComponentLink1Description: 供应商链接; ComponentLink1URL: http://www.szlcsc.com/product/details_35434.html; Package: TO-263-5; Supplier: LC; SuppliersPartNumber: C34465
U8 = EEPROM/AT24C256C-SSHL-T_[C6482]: EEPROM; ComponentLink1Description: 供应商链接; ComponentLink1URL: http://www.szlcsc.com/product/details_6947.html; Package: SOIC-8_150mil; Supplier: LC; SuppliersPartNumber: C6482
VR1 = SOT-223 AMS1117-3.3: 低压差线性稳压(LDO); ComponentLink1Description: 供应商链接; ComponentLink1URL: http://www.szlcsc.com/product/details_6652.html; Package: SOT-223; Supplier: LC; SuppliersPartNumber: C6186
Y1 = SMD-5032_2P 8MHz 20ppm 20pF: 贴片晶振; ComponentLink1Description: 供应商链接; ComponentLink1URL: http://www.szlcsc.com/product/details_117214.html; Package: SMD-5032_2P; Supplier: LC; SuppliersPartNumber: C115962
Y2 = SMD-3215_2P 32.768KHz 20ppm 12.5pF: 贴片晶振; ComponentLink1Description: 供应商链接; ComponentLink1URL: http://www.szlcsc.com/product/details_33310.html; Package: SMD-3215_2P; Supplier: LC; SuppliersPartNumber: C32346